# EAGLE design cervus_2_0 (EAGLE 6.4)
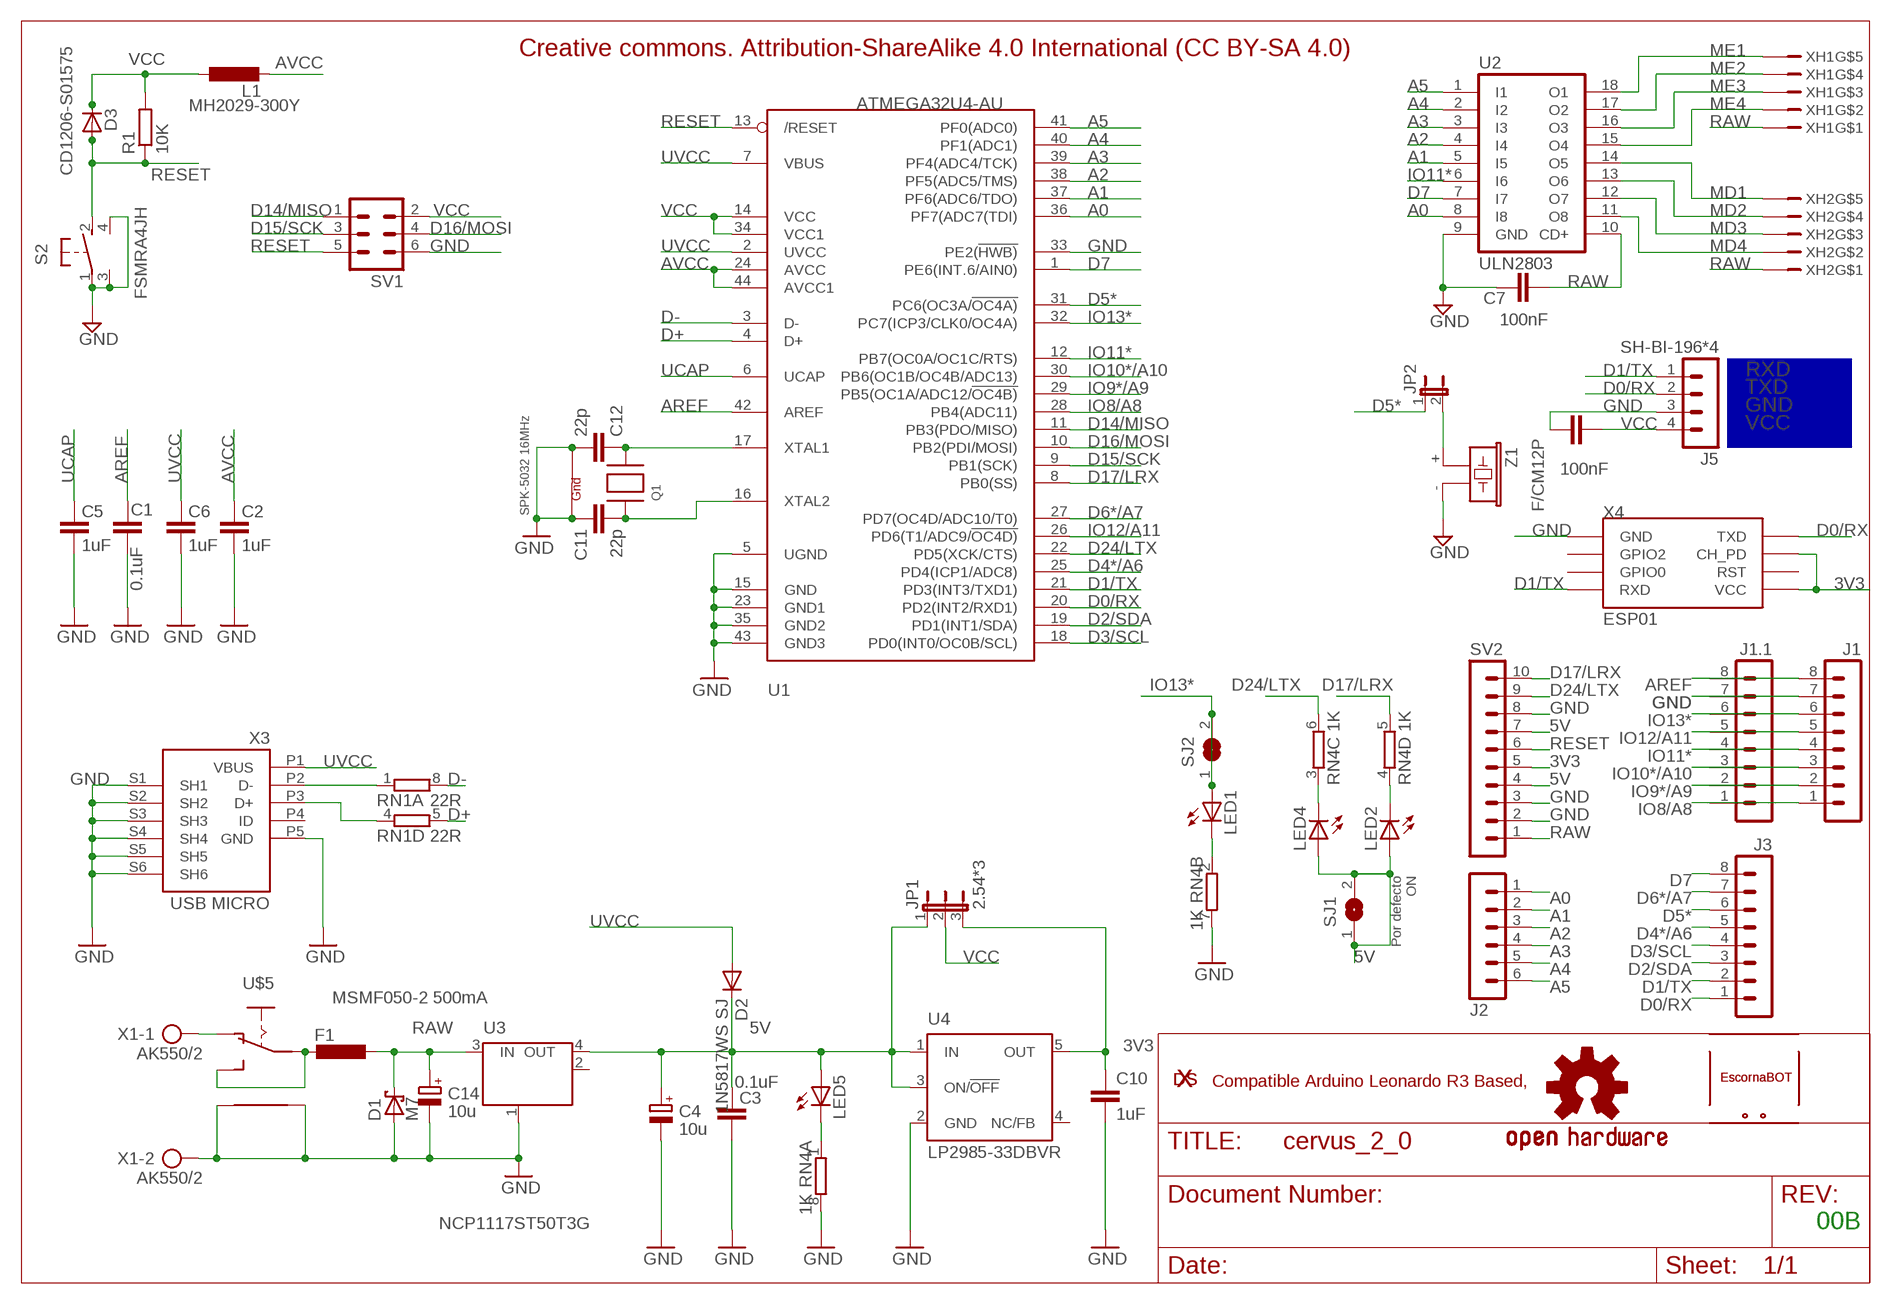
[diagram p0: schematic, sheet 1]

## Parts
C1  0.1uF  CAP0603-CAP  [0603-CAP]
C2  1uF  CAP0603-CAP  [0603-CAP]
C3  0.1uF  CAP0603-CAP  [0603-CAP]
C4  10u  CPOL-EUSMCB  [SMC_B]
C5  1uF  CAP0603-CAP  [0603-CAP]
C6  1uF  CAP0603-CAP  [0603-CAP]
C7  100nF  C-EUC0603K  [C0603K]
C8  100nF  C-EUC0603K  [C0603K]
C10  1uF  CAP0603-CAP  [0603-CAP]
C11  22p  C-EUC0603  [C0603-ROUND]
C12  22p  C-EUC0603  [C0603-ROUND]
C14  10u  CPOL-EUSMCB  [SMC_B]
D1  M7  SCHOTTKY-DIODESMA  [SMA]
D2  1N5817WS SJ  DIODESOD  [SOD-323]
D3  CD1206-S01575  DIODE-MINIMELF  [MINIMELF]
F1  MSMF050-2 500mA  L-EUL1812  [L1812]
J1  MA08-1  [MA08-1]
J1.1  MA08-1  [MA08-1]
J2  MA06-1  [MA06-1]
J3  MA08-1  [MA08-1]
J5  SH-BI-196*4  MA04-1  [MA04-1]
JP1  2.54*3  JP2E  [JP2]
JP2  JP1E  [JP1]
L1  MH2029-300Y  L-EU  [R0805]
LED1  LEDCHIPLED_0603  [CHIPLED_0603]
LED2  LEDCHIPLED_0603  [CHIPLED_0603]
LED4  LEDCHIPLED_0603  [CHIPLED_0603]
LED5  LEDCHIPLED_0603  [CHIPLED_0603]
LOGO1  OSHW-LOGOS  [OSHW-LOGO-S]
Q1  SPK-5032 16MHz  XTAL-4-3225  [NX3225]
R1  10K  R-EU_R0603  [R0603]
RN1  22R  4R-NCAY16  [CAY16]
RN4  1K  4R-NCAY16  [CAY16]
S2  FSMRA4JH  31-XX  [B3F-31XX]
SJ1  SJ  [SJ]
SJ2  SJ  [SJ]
SV1  MA03-2  [MA03-2]
SV2  MA10-1  [MA10-1]
U1  ATMEGA32U4-AU  [TQFP44]
U2  ULN2803  ULN2803A"  [DIL18]
U3  NCP1117ST50T3G  MC33269ST-3.3T3  [SOT223]
U4  LP2985-33DBVR  LP2985-XXDBVR33  [SOT23-DBV]
U$1  XDESIG  [XDESIG_CU_2]
U$2  XDESIG  [XDESIG_CU_2]
U$3  ESCORNABOT  [ESCORNA_PEQUE]
U$4  ESCORNABOT  [ESCORNA_PEQUE]
U$5  ESCORNA_SK12F14D  [ESCORNA_SK-12D07]
X1  AK550/2  [AK550/2]
X3  USB MICRO  MYCON2_USB-MINI-B  [CON2_USB_MICRO_B_AT]
X4  ESP01  [ESP01]
XH1  XH2.54-5P  B5B-XH-A  [B5B-XH-A]
XH2  XH2.54-5P  B5B-XH-A  [B5B-XH-A]
Z1  F/CM12P  [F/CM12P]

## Nets
3V3: C10.1 JP1.3 SV2.5 U4.5(OUT) X4.CH_PD X4.VCC
5V: C3.2 C4.+ D2.1(C) JP1.1 LED2.A LED4.A LED5.A SJ1.1 SJ1.2 SV2.4 SV2.7 U3.4(OUT) U4.1(IN) U4.3(ON/!OFF)
A0: J2.1 U1.36(PF7(ADC7(TDI)) U2.8(I8)
A1: J2.2 U1.37(PF6(ADC6/TDO)) U2.5(I5)
A2: J2.3 U1.38(PF5(ADC5/TMS)) U2.4(I4)
A3: J2.4 U1.39(PF4(ADC4/TCK)) U2.3(I3)
A4: J2.5 U1.40(PF1(ADC1)) U2.2(I2)
A5: J2.6 U1.41(PF0(ADC0)) U2.1(I1)
AREF [aref]: C1.2 J1.1.8 J1.8 U1.42(AREF)
AVCC: C2.2 L1.2 U1.24(AVCC) U1.44(AVCC1)
D0/RX: J3.1 J5.2 U1.20(PD2(INT2/RXD1)) X4.TX(TXD)
D1/TX: J3.2 J5.1 U1.21(PD3(INT3/TXD1)) X4.RX(RXD)
D2/SDA: J3.3 U1.19(PD1(INT1/SDA))
D3/SCL: J3.4 U1.18(PD0(INT0/OC0B/SCL))
D4*/A6: J3.5 U1.25(PD4(ICP1/ADC8))
D5*: J3.6 JP2.1 U1.31(PC6(OC3A/!OC4A))
D6*/A7: J3.7 U1.27(PD7(OC4D/ADC10/T0))
D7: J3.8 U1.1(PE6(INT.6/AIN0)) U2.7(I7)
D14/MISO: SV1.1 U1.11(PB3(PDO/MISO))
D15/SCK: SV1.3 U1.9(PB1(SCK))
D16/MOSI: SV1.4 U1.10(PB2(PDI/MOSI))
D17/LRX: RN4.5 SV2.10 U1.8(PB0(SS))
D24/LTX: RN4.6 SV2.9 U1.22(PD5(XCK/CTS))
D+: RN1.5 U1.4(D+)
D-: RN1.8 U1.3(D-)
GND [power]: C1.1 C2.1 C3.1 C4.- C5.1 C6.1 C7.1 C8.1 C10.2 C11.1 C12.2 C14.- D1.A J1.1.7 J1.7 J5.3 Q1.2(G2) Q1.4(G1) RN4.7 RN4.8 S2.1(P) S2.3(CH2) S2.4(CH1) SV1.6 SV2.2 SV2.3 SV2.8 U1.5(UGND) U1.15(GND) U1.23(GND1) U1.33(PE2(!HWB)) U1.35(GND2) U1.43(GND3) U2.9(GND) U3.1(GND/ADJ) U4.2(GND) U$5.P$4 U$5.P$5 X1.2 X3.P5(GND) X3.S1(SH1) X3.S2(SH2) X3.S3(SH3) X3.S4(SH4) X3.S5(SH5) X3.S6(SH6) X4.GND Z1.-
IO8/A8: J1.1 J1.1.1 U1.28(PB4(ADC11))
IO9*/A9: J1.1.2 J1.2 U1.29(PB5(OC1A/ADC12/!OC4B))
IO10*/A10: J1.1.3 J1.3 U1.30(PB6(OC1B/OC4B/ADC13))
IO11*: J1.1.4 J1.4 U1.12(PB7(OC0A/OC1C/RTS)) U2.6(I6)
IO12/A11: J1.1.5 J1.5 U1.26(PD6(T1/ADC9/!OC4D))
IO13*: J1.1.6 J1.6 LED1.A SJ2.1 SJ2.2 U1.32(PC7(ICP3/CLK0/OC4A))
MD1: U2.14(O5) XH2.P$5
MD2: U2.13(O6) XH2.P$4
MD3: U2.12(O7) XH2.P$3
MD4: U2.11(O8) XH2.P$2
ME1: U2.18(O1) XH1.P$5
ME2: U2.17(O2) XH1.P$4
ME3: U2.16(O3) XH1.P$3
ME4: U2.15(O4) XH1.P$2
N$1: LED5.C RN4.1
N$2: LED1.C RN4.2
N$3: LED4.C RN4.3
N$4: LED2.C RN4.4
N$5: F1.2 U$5.P$1(P) U$5.P$3(S)
N$6: C11.2 Q1.1(X1) U1.16(XTAL2)
N$9: C12.1 Q1.3(X2) U1.17(XTAL1)
N$11: JP2.2 Z1.+
N$13: RN1.1 X3.P2(D-)
N$14: RN1.4 X3.P3(D+)
N$15: U$5.P$2(O) X1.1
RAW: C7.2 C14.+ D1.C F1.1 SV2.1 U2.10(CD+) U3.3(IN) XH1.P$1 XH2.P$1
RESET: D3.A R1.1 S2.2(S) SV1.5 SV2.6 U1.13(/RESET)
UCAP: C5.2 U1.6(UCAP)
UVCC: C6.2 D2.2(A) U1.2(UVCC) U1.7(VBUS) X3.P1(VBUS)
VCC: C8.2 D3.C J5.4 JP1.2 L1.1 R1.2 SV1.2 U1.14(VCC) U1.34(VCC1)
Unconnected: RN1.2 RN1.3 RN1.6 RN1.7 U3.2(OUT) U4.4(NC/FB) X3.P4(ID) X4.GPIO0 X4.GPIO2 X4.RST

## Notes on the sheet
- Creative commons. Attribution-ShareAlike 4.0 International (CC BY-SA 4.0)
- RXD
- TXD
- GND
- VCC
- Por defecto
  ON
- Compatible Arduino Leonardo R3 Based,
- 00B

## Library data of the parts
C1-C3 C5 C6 C10 = SparkFun:CAP: Capacitor Standard 0603 ceramic capacitor, and 0.1" leaded capacitor.
C4 C14 = rcl:CPOL-EU: POLARIZED CAPACITOR, European symbol
C7 C8 = rcl:C-EU: CAPACITOR, European symbol
C11 C12 = SmartPrj:C-EU: CAPACITOR, European symbol
D1 = diode:SCHOTTKY-DIODE: Schottky Diode
D2 = SparkFun:DIODE: Diode These are standard reverse protection diodes and small signal diodes. SMA package can handle up to about 1A. SOD-323 can handle about 200mA. What the SOD-323 package when ordering, there are some mfgs out there that are 5-pin packages.
D3 = diode:DIODE-: DIODE
F1 L1 = rcl:L-EU: INDUCTOR, European symbol
J1 J1.1 J3 = con-lstb:MA08-1: PIN HEADER; OC_FARNELL: unknown; OC_NEWARK: unknown
J2 = con-lstb:MA06-1: PIN HEADER; OC_FARNELL: unknown; OC_NEWARK: unknown
J5 = con-lstb:MA04-1: PIN HEADER; OC_FARNELL: unknown; OC_NEWARK: unknown
JP1 = jumper:JP2E: JUMPER
JP2 = jumper:JP1E: JUMPER
LED1 LED2 LED4 LED5 = led:LED: LED OSRAM: - CHIPLED LG R971, LG N971, LY N971, LG Q971, LY Q971, LO R971, LY R971 LH N974, LH R974 LS Q976, LO Q976, LY Q976 LO Q996 - Hyper CHIPLED LW Q18S LB Q993, LB Q99A, LB R99A - SideLED LS A670, LO A670, LY A670, LG A670, LP A670 LB A673, LV A673, LT A673, LW A673 LH A674 LY A675 LS A676, LA A676, LO A676, LY A676, LW A676 LS A679, LY A679, LG A679 - Hyper Micro SIDELED® LS Y876, LA Y876, LO Y876, LY Y876 LT Y87S - SmartLED LW L88C, LW L88S LB L89C, LB L89S, LG L890 LS L89K, LO L89K, LY L89K LS L896, LA L896, LO L896, LY L896 - TOPLED LS T670, LO T670, LY T670, LG T670, LP T670 LSG T670, LSP T670, LSY T670, LOP T670, LYG T670 LG T671, LOG T671, LSG T671 LB T673, LV T673, LT T673, LW T673 LH T674 LS T676, LA T676, LO T676, LY T676, LB T676, LH T676, LSB T676, LW T676 LB T67C, LV T67C, LT T67C, LS T67K, LO T67K, LY T67K, LW E67C LS E67B, LA E67B, LO E67B, LY E67B, LB E67C, LV E67C, LT E67C LW T67C LS T679, LY T679, LG T679 LS T770, LO T770, LY T770, LG T770, LP T770 LB T773, LV T773, LT T773, LW T773 LH T774 LS E675, LA E675, LY E675, LS T675 LS T776, LA T776, LO T776, LY T776, LB T776 LHGB T686 LT T68C, LB T68C - Hyper Mini TOPLED® LB M676 - Mini TOPLED Santana® LG M470 LS M47K, LO M47K, LY M47K Source: http://www.osram.convergy.de LUXEON: - LUMILED® LXK2-PW12-R00, LXK2-PW12-S00, LXK2-PW14-U00, LXK2-PW14-V00 LXK2-PM12-R00, LXK2-PM12-S00, LXK2-PM14-U00 LXK2-PE12-Q00, LXK2-PE12-R00, LXK2-PE12-S00, LXK2-PE14-T00, LXK2-PE14-U00 LXK2-PB12-K00, LXK2-PB12-L00, LXK2-PB12-M00, LXK2-PB14-N00, LXK2-PB14-P00, LXK2-PB14-Q00 LXK2-PR12-L00, LXK2-PR12-M00, LXK2-PR14-Q00, LXK2-PR14-R00 LXK2-PD12-Q00, LXK2-PD12-R00, LXK2-PD12-S00 LXK2-PH12-R00, LXK2-PH12-S00 LXK2-PL12-P00, LXK2-PL12-Q00, LXK2-PL12-R00 Source: www.luxeon.com KINGBRIGHT: KA-3528ASYC Source: www.kingbright.com
LOGO1 = SparkFun-Aesthetics:OSHW-LOGO: Open Source Hardware Logo This logo indicates the piece of hardware it is found on incorporates a OSHW license and/or adheres to the definition of open source hardware found here: http://freedomdefined.org/OSHW
Q1 = adafruit:XTAL-4: Classic 4-pin 3.2 x 2.5mm crystal
R1 = rcl:R-EU_: RESISTOR, European symbol
RN1 RN4 = resistor-dil:4R-N: Array Chip Resistor Source: RS Component / Phycomp
S2 = switch-omron:31-XX: OMRON SWITCH; MPN: B3F-3100; OC_FARNELL: 959704; OC_NEWARK: 36M3582
SJ1 SJ2 = jumper:SJ: SMD solder JUMPER
SV1 = con-lstb:MA03-2: PIN HEADER; OC_FARNELL: unknown; OC_NEWARK: unknown
SV2 = con-lstb:MA10-1: PIN HEADER; OC_FARNELL: unknown; OC_NEWARK: unknown
U1 = adafruit:ATMEGA32U4: http://www.ladyada.net/library/eagle
U2 = uln-udn:ULN2803A: DRIVER ARRAY
U3 = linear:MC33269ST*: Adjustable Output Low Dropout Voltage Regulator 800 mA Source: http://www.onsemi.com/pub/Collateral/MC33269-D.PDF
U4 = SmartPrj:LP2985-XXDBVR: ULTRALOW-POWER 50-mA LOW-DROPOUT LINEAR REGULATORS 50-mA Low-Dropout Regulator Source: http://focus.ti.com/lit/ds/symlink/tps77001.pdf
U$1 U$2 = xdesig:XDESIG
U$3 U$4 = escorna:ESCORNABOT
U$5 = Escorna_CPU_2_01:ESCORNA_SK12F14
X1 = con-ptr500:AK550/2: CONNECTOR; OC_FARNELL: unknown; OC_NEWARK: unknown
X3 = SmartPrj:MYCON2_USB-MINI-B
X4 = esp8266modules:ESP01: ESP8266 Wifi module 01
XH1 XH2 = con-jst:B5B-XH-A
Z1 = buzzer:F/CM12P: BUZZER Source: Buerklin; OC_FARNELL: unknown; OC_NEWARK: unknown

## Net classes
0 default: width 0.254 mm, drill 0.61 mm, clearance 0.254 mm
1 power: width 0.254 mm, drill 0.61 mm, clearance 0.254 mm
2 gnd: width 0.254 mm, drill 0.61 mm, clearance 0.254 mm
3 usbvcc: width 0.254 mm, drill 0.61 mm, clearance 0.254 mm
4 aref: width 0.254 mm, drill 0.61 mm, clearance 0.254 mm

## Board
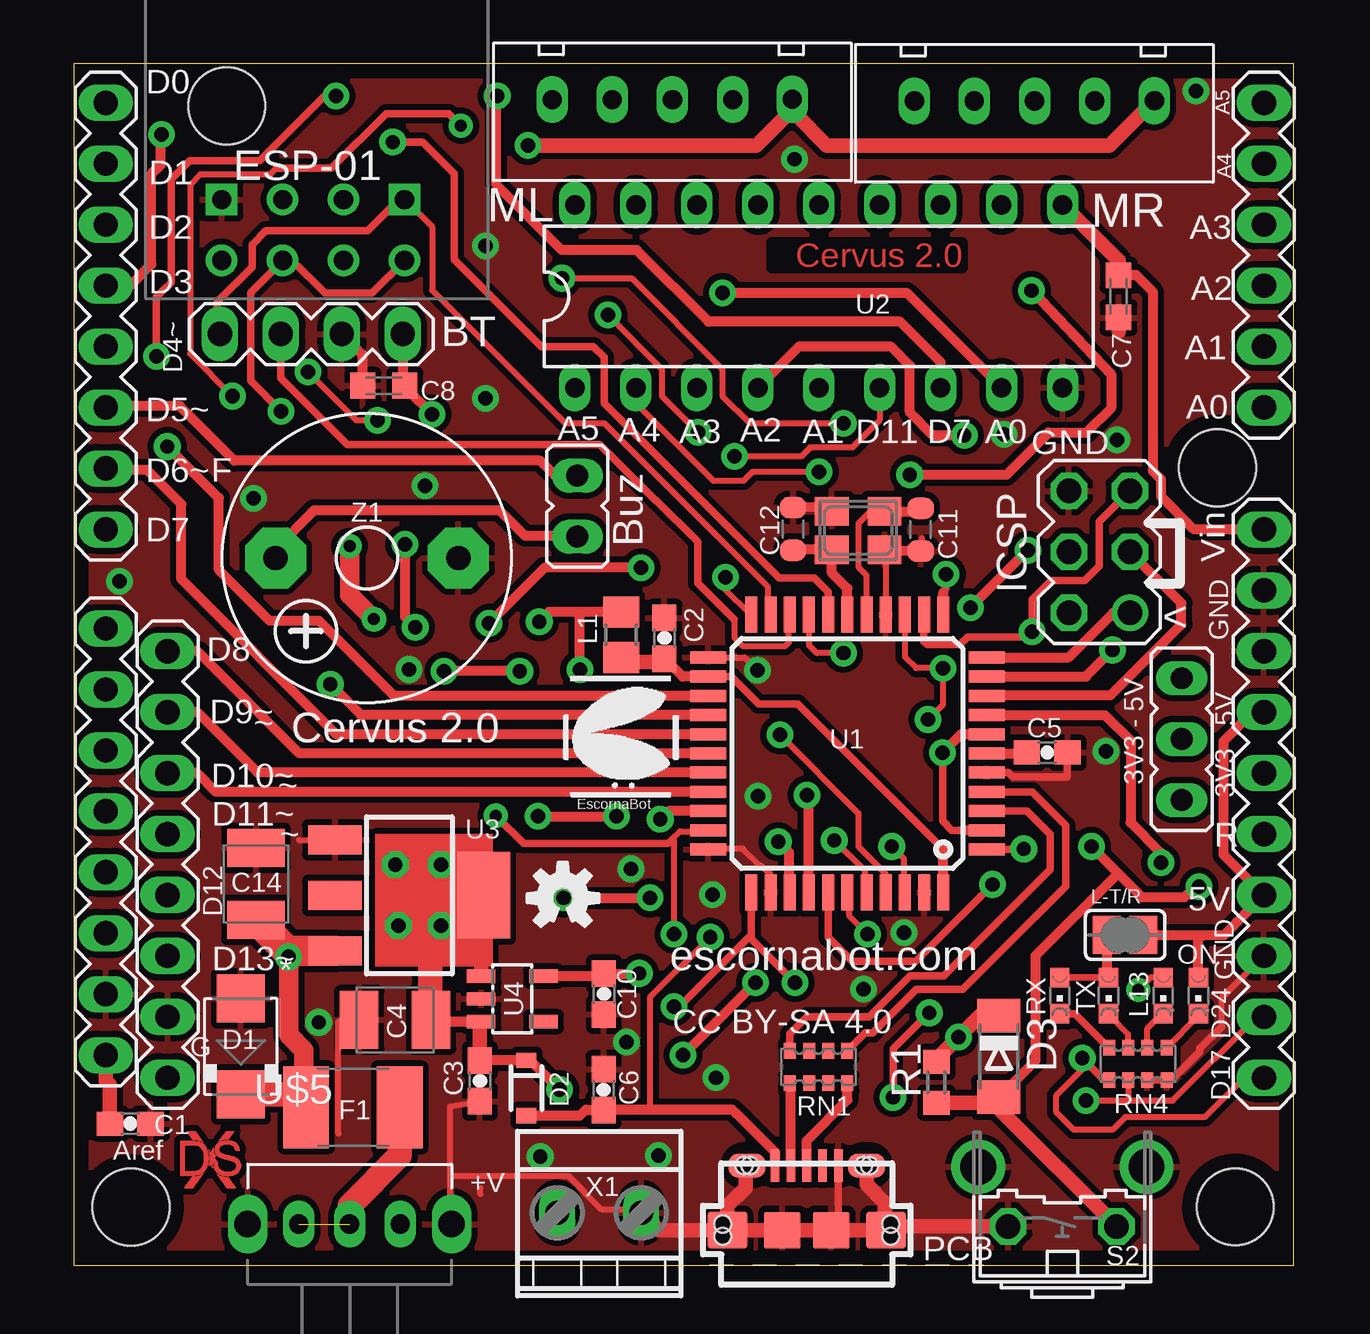
[diagram p1: board, top side]
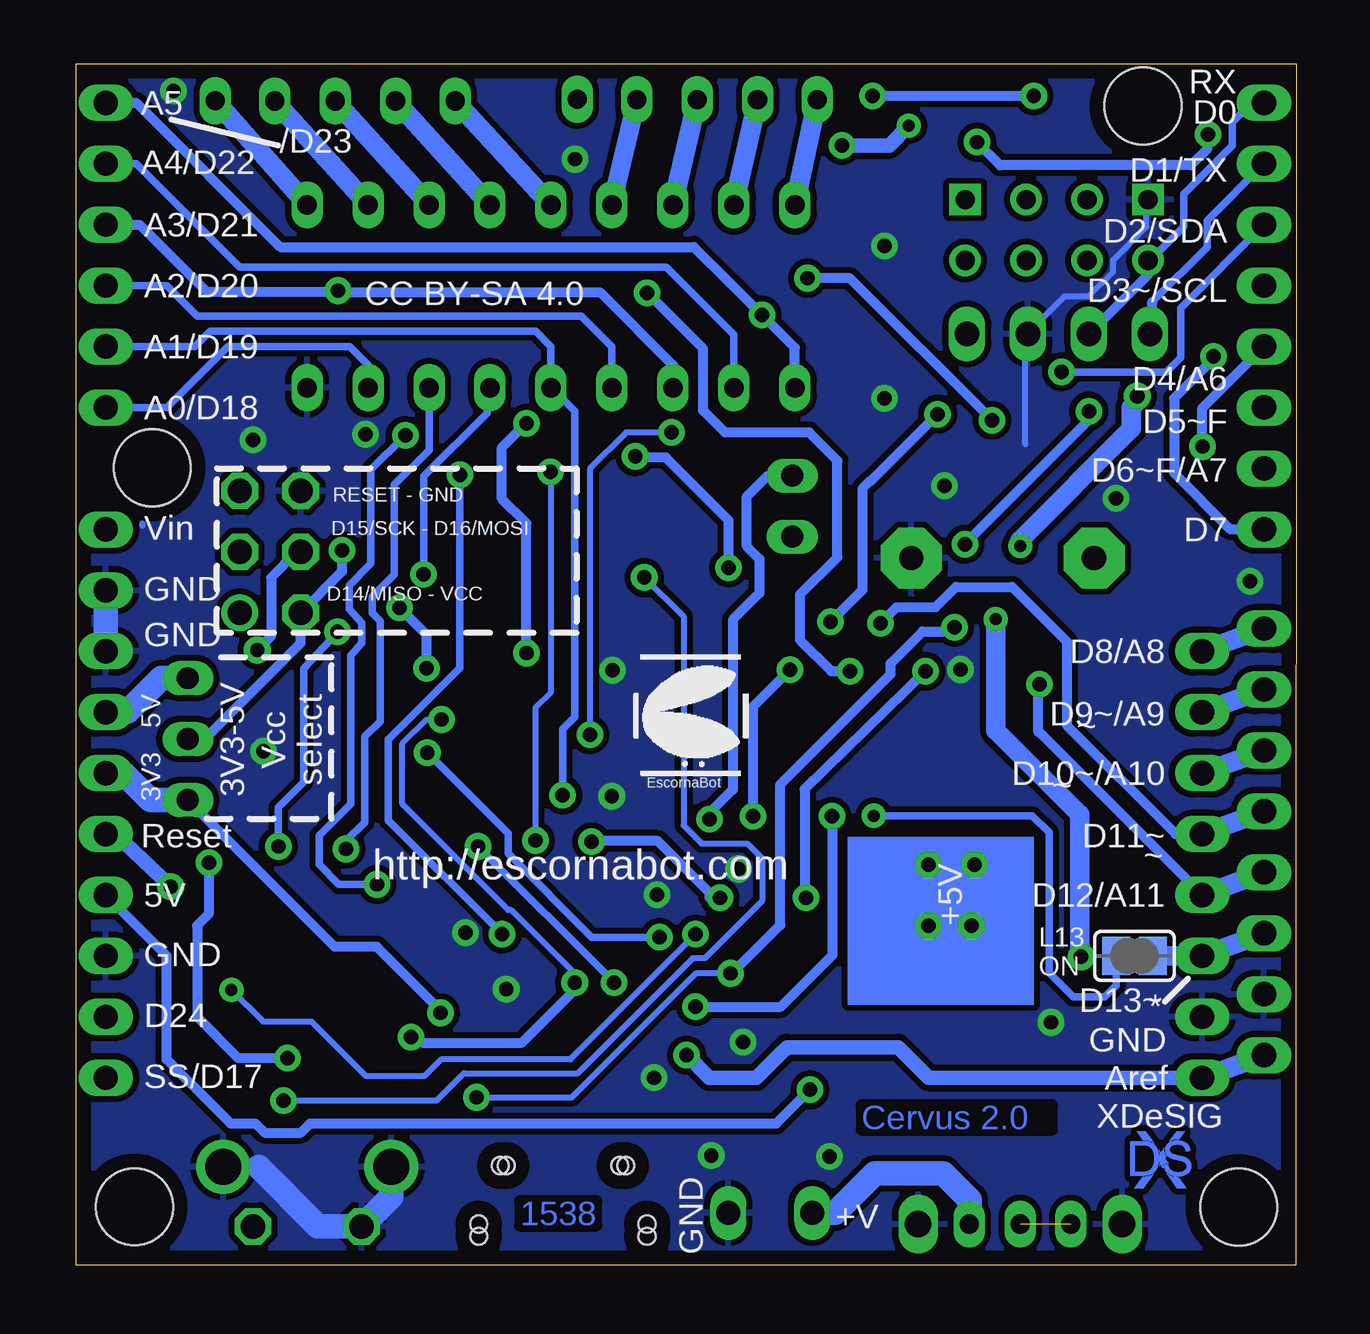
[diagram p2: board, bottom side, seen from below]

Size 50.83 x 50.08 mm. Coordinates in mm from the lower left corner, seen from the top.
Outline: 50.83,50.08 0,50.08 0,0 50.83,0.01 50.83,50.08
Copper layers (1*16): Top 0.035mm / dielectric 1.5mm / Bottom 0.035mm
Design rules "default *": minimum track width 10mil, minimum drill 22mil, track to track 10mil, track to pad 10mil, pad to pad 8mil, via to via 12mil, smd to smd 8mil, copper to edge 24mil, drill to drill 12mil, minimum pad ring 10mil, minimum via ring 10mil, stop-mask expansion 2mil, vias tented up to drill 30mil, thermal gap 10mil
Holes 3.2 mm at 6.38,48.32 48.4,2.43 2.39,2.42 47.66,33.24
tRestrict: area 31.8,30.9 to 34.3,32.1; area 33.4,27.8 to 35.9,29.1; area 34.1,27.6 to 36.6,28.9; area 36.1,18.4 to 37.3,20.9; area 26.9,16.8 to 27.6,25.3; area 33.5,16.3 to 36,17.6; area 43.6,7.8 to 46.1,9.1

### Footprints (pad centres in the part's own frame; a part is rotated, then mirrored left to right if it is on the bottom)
0603-CAP = smd 1.1 x 1: 1 -0.85,0; 2 0.85,0
SMC_B = smd 1.6 x 2.4: + -1.5,0; - 1.5,0
C0603K = smd 1.05 x 1.08: 1 -0.875,0; 2 0.875,0
C0603-ROUND = smd 0.898 x 1.1: 1 -0.889,0; 2 0.889,0
SMA = smd 2 x 2: A 2,0; C -2,0
SOD-323 = smd 0.63 x 0.83: 1 -1.15,0; 2 1.15,0
MINIMELF = smd 1.4 x 1.8: A 1.7,0; C -1.7,0
L1812 = smd 1.9 x 3.4: 1 -1.95,0; 2 1.95,0
MA08-1 = drill 1.016 long: 1 -8.89,0; 2 -6.35,0; 3 -3.81,0; 4 -1.27,0; 5 1.27,0; 6 3.81,0; 7 6.35,0; 8 8.89,0
MA06-1 = drill 1.016 long: 1 -6.35,0; 2 -3.81,0; 3 -1.27,0; 4 1.27,0; 5 3.81,0; 6 6.35,0
MA04-1 = drill 1.016 long: 1 -3.81,0; 2 -1.27,0; 3 1.27,0; 4 3.81,0
JP2 = drill 0.914 long: 1 -2.54,0; 2 0,0; 3 2.54,0
JP1 = drill 0.914 long: 1 0,-1.27; 2 0,1.27
R0805 = smd 1.3 x 1.5: 1 -0.95,0; 2 0.95,0
CHIPLED_0603 = smd 0.8 x 0.8: A 0,-0.75; C 0,0.75
NX3225 = smd 1.4 x 1.2: 1 -1.1,-0.8; 2 1.1,-0.8; 3 1.1,0.8; 4 -1.1,0.8
R0603 = smd 1 x 1.1: 1 -0.85,0; 2 0.85,0
CAY16 = smd 0.5 x 0.65: 1 -1.2,-0.675; 2 -0.4,-0.675; 3 0.4,-0.675; 4 1.2,-0.675; 5 1.2,0.675; 6 0.4,0.675; 7 -0.4,0.675; 8 -1.2,0.675
B3F-31XX = drill 1.016 octagon: 1 -2.261,-1.245; 2 2.261,-1.245 | drill 1.499 pad 2.159: 3 -3.505,1.245; 4 3.505,1.245
SJ = smd 1.168 x 1.6: 1 -0.762,0; 2 0.762,0
MA03-2 = drill 1.016: 1 -2.54,-1.27 | drill 1.016 octagon: 2 -2.54,1.27; 3 0,-1.27; 4 0,1.27; 5 2.54,-1.27; 6 2.54,1.27
MA10-1 = drill 1.016 long: 1 -11.43,0; 2 -8.89,0; 3 -6.35,0; 4 -3.81,0; 5 -1.27,0; 6 1.27,0; 7 3.81,0; 8 6.35,0; 9 8.89,0; 10 11.43,0
TQFP44 = smd 1.5 x 0.5: 1 -5.8,4; 2 -5.8,3.2; 3 -5.8,2.4; 4 -5.8,1.6; 5 -5.8,0.8; 6 -5.8,0; 7 -5.8,-0.8; 8 -5.8,-1.6; 9 -5.8,-2.4; 10 -5.8,-3.2; 11 -5.8,-4; 23 5.8,-4; 24 5.8,-3.2; 25 5.8,-2.4; 26 5.8,-1.6; 27 5.8,-0.8; 28 5.8,0; 29 5.8,0.8; 30 5.8,1.6; 31 5.8,2.4; 32 5.8,3.2; 33 5.8,4 | smd 0.5 x 1.5: 12 -4,-5.8; 13 -3.2,-5.8; 14 -2.4,-5.8; 15 -1.6,-5.8; 16 -0.8,-5.8; 17 0,-5.8; 18 0.8,-5.8; 19 1.6,-5.8; 20 2.4,-5.8; 21 3.2,-5.8; 22 4,-5.8; 34 4,5.8; 35 3.2,5.8; 36 2.4,5.8; 37 1.6,5.8; 38 0.8,5.8; 39 0,5.8; 40 -0.8,5.8; 41 -1.6,5.8; 42 -2.4,5.8; 43 -3.2,5.8; 44 -4,5.8
DIL18 = drill 0.813 long: 1 -10.16,-3.81; 2 -7.62,-3.81; 3 -5.08,-3.81; 4 -2.54,-3.81; 5 0,-3.81; 6 2.54,-3.81; 7 5.08,-3.81; 8 7.62,-3.81; 9 10.16,-3.81; 10 10.16,3.81; 11 7.62,3.81; 12 5.08,3.81; 13 2.54,3.81; 14 0,3.81; 15 -2.54,3.81; 16 -5.08,3.81; 17 -7.62,3.81; 18 -10.16,3.81
SOT223 = smd 1.219 x 2.235: 1 -2.311,-3.099; 2 0,-3.099; 3 2.311,-3.099 | smd 3.6 x 2.2: 4 0,3.099
SOT23-DBV = smd 0.55 x 1.2: 1 -0.95,-1.3; 2 0,-1.3; 3 0.95,-1.3; 4 0.95,1.3; 5 -0.95,1.3
ESCORNA_SK-12D07 = drill 0.8 long: P$1 0,0; P$2 2.115,0; P$3 -2.115,0 | drill 1.1 pad 1.422 long: P$4 -4.25,0; P$5 4.25,0
AK550/2 = drill 1 pad 1.5 long: 1 -1.75,0; 2 1.75,0
CON2_USB_MICRO_B_AT = smd 0.406 x 1.346: P1 -1.321,2.692; P2 -0.66,2.692; P3 0,2.692; P4 0.66,2.692; P5 1.321,2.692 | smd 1.651 x 1.549: S1 -3.302,0; S2 3.302,0 | smd 1.524 x 1.016: S3 -2.489,2.692; S4 2.489,2.692 | smd 1.524 x 1.524: S5 -1.016,0; S6 1.016,0 | hole 0.7: -3.505,0.254; -3.505,-0.254; 3.505,0.254; 3.505,-0.254; -2.616,2.692; -2.362,2.692; 2.362,2.692; 2.616,2.692
ESP01 = drill 0.8: CH_PD -1.285,-8.178; GPIO0 1.255,-5.638; GPIO2 -1.285,-5.638; RST 1.255,-8.178; TX -3.825,-8.178; VCC 3.795,-8.178 | drill 0.8 square: GND -3.825,-5.638; RX 3.795,-5.638
B5B-XH-A = drill 0.8 long: P$1 -5.17,-0.19; P$2 -2.69,-0.175; P$3 -0.175,-0.175; P$4 2.34,-0.175; P$5 4.83,-0.175
F/CM12P = drill 1.016 pad 2.54 octagon: + 3.81,0; - -3.81,0

### Placement (x,y rotation side)
C1  2.36,5.9 180 top
C2  24.62,26.14 270 top
C3  16.93,7.68 90 top
C4  13.4,10.22 180 top
C5  40.56,21.37 180 top
C6  22.08,7.32 270 top
C7  43.54,40.38 90 top
C8  12.93,36.66 0 top
C10  22.1,11.3 270 top
C11  35.3,30.66 90 top
C12  29.98,30.69 90 top
C14  7.6,15.89 90 top
D1  6.96,9.12 90 top
D2  18.86,7.39 270 top
D3  38.55,8.7 270 top
F1  11.64,6.58 0 top
J1  3.91,16.7 270 top
J1.1  1.34,17.65 270 top
J2  49.6,42.1 90 top
J3  1.34,39.56 270 top
J5  9.9,38.82 0 top
JP1  46.17,21.93 270 top
JP2  20.99,31.64 180 top
L1  22.81,26.28 270 top
LED1  45.4,11.24 180 top
LED2  41.09,11.24 180 top
LED4  43.12,11.24 180 top
LED5  46.87,11.24 180 top
LOGO1  20.38,15.3 0 top
Q1  32.69,30.62 180 top
R1  35.94,7.62 90 top
RN1  31.04,8.26 0 top
RN4  44.34,8.39 180 top
S2  41.2,2.86 0 top
SJ1  43.81,13.77 180 top
SJ2  6.73,12.89 0 bottom
SV1  42.74,29.73 90 top
SV2  49.6,19.24 270 top
U1  32.24,21.33 180 top
U2  31.05,40.39 0 top
U3  13.99,15.42 270 top
U4  18.28,11.1 270 top
U$1  4.44,3.22 0 top
U$2  6.89,3.21 0 bottom
U$3  20.33,19.42 0 top
U$4  27.69,20.32 0 bottom
U$5  11.5,1.72 0 top
X1  21.9,2.18 0 top
X3  30.55,1.46 0 top
X4  9.99,50.06 0 top
XH1  24.78,48.41 180 top
XH2  39.86,48.35 180 top
Z1  12.22,29.48 180 top

### Tracks (layer width: path | path; a pad name or v marks a point on that pad's centre or on a via)
3V3  (via drill 0.6)
  Top 0.305: v34.14,7 34.14,9.01 v35.65,10.52 | X4.VCC 12.42,40.51 10.48,40.51 9.12,41.88 X4.CH_PD 7.37,40.54 7.37,36.86 v8.63,35.6
  Top 0.406: v13.8,30.05 13.8,27.02 v14.23,26.59 | U4.5 22,12.05 C10.1 23.55,12.15 v23.56,12.16
  Bottom 0.254: v34.14,7 30.18,7 25.01,12.16 v23.56,12.16 23.5,12.16 | 45.8,19.09 JP1.3 | 8.63,35.22 v8.63,35.6
  Bottom 0.406: v13.8,30.05 8.63,35.22 | 23.5,12.16 21.48,14.18 21.48,20.05 16.89,24.64 16.89,25.08 15.56,26.42 14.41,26.42 v14.23,26.59 | v35.65,10.52 35.65,10.63 38.29,13.27 40.06,13.27 JP1.3
  Bottom 1.016: JP1.3 47.73,19.39 48.82,20.47 49.55,20.47 SV2.5
5V  (via drill 0.6)
  Top 0.254: SJ1.2 SJ1.1 | 16.95,10.15 U4.3 16.82,10.15 | 16.95,8.51 C3.2 16.95,8.38 17.06,8.54 | 14.93,10.52 14.93,10.27 C4.+ 14.93,10.15 | 41.13,11.99 LED4.A LED2.A
  Top 0.305: LED4.A 43.08,11.99 43.05,12.02
  Top 0.406: 49.12,23.05 47.91,21.84 47.91,17.12 SV2.7 | v20.25,7.31 19.15,8.41 D2.1 17.06,8.54 | 48.46,14.3 SV2.7 | SJ1.1 46.93,13.77 | 46.93,13.77 47.05,13.77 | 47.05,13.77 47.93,13.77 SV2.7 | 46.89,13.68 46.93,13.77 | SJ1.2 43.05,12.02 | 16.95,10.15 14.98,10.15 C4.+ | 15.13,12.05 14.86,12.32 | U3.4 17.84,16.17 17.84,16.7 v15.31,16.7 v13.4,16.7 | v13.53,14.16 v15.31,14.16 | 16.57,14.16 v15.31,14.16 | v15.31,14.16 15.31,13.34 14.86,12.89 | LED5.A 46.87,13.58 47.05,13.77
  Top 0.61: SV2.4 49.12,23.05 | C3.2 16.93,10.1 U4.3 | U4.1 16.98,13.76 16.57,14.16
  Top 1.016: U3.4 17.09,15.37 14.86,13.15 14.86,12.89 14.86,12.32 14.86,10.26 C4.+
  Bottom 0.254: 49.58,15.31 SV2.7
  Bottom 0.406: 48.69,23.07 48.35,23.07 48.33,23.05 | v20.25,7.31 21.66,5.91 41.08,5.91 41.47,5.52 42.97,5.52 43.36,5.91 44.39,5.91 46.02,7.54 46.03,7.54 47.06,8.58 47.06,12.9 SV2.7
  Bottom 1.016: JP1.1 47.29,24.47 48.69,23.07 49.58,23.07 SV2.4
A0  (via drill 0.6)
  Top 0.254: 29.8,15.56 U1.36
  Top 0.406: 29.8,15.56 29.8,17.21 v29.36,17.66 | v20.41,15.31 v24,15.31 | v18.59,24.76 v15.43,24.76 | v27.04,40.54 34.71,40.54 U2.8
  Bottom 0.305: J2.1 47.05,35.75 44.52,38.29 39.44,38.29 38.66,37.52 U2.8
  Bottom 0.406: v15.43,24.76 20.48,19.85 20.48,15.38 v20.41,15.31 | v27.04,40.54 24.7,38.2 24.7,35.62 23.79,34.71 20.28,34.71 19.11,33.54 19.11,29.51 20.67,27.95 20.67,26.07 19.37,24.77 v18.59,24.77 v18.59,24.76 | v24,15.31 24.43,15.31 24.43,15.53 26.59,17.68 29.34,17.68 v29.36,17.66
A1  (via drill 0.6)
  Top 0.406: U1.37 30.64,19.52 v30.56,19.6
  Bottom 0.254: 30.93,36.48 U2.5
  Bottom 0.305: U2.5 31.05,38.29 31.68,38.93 45.24,38.93 45.88,38.29 J2.2 | v30.56,19.6 30.56,22.35 30.05,22.85 30.05,35.6 30.93,36.48
A2  (via drill 0.6)
  Top 0.254: 31.44,15.44 U1.38 | 28.54,36.61 U2.4
  Top 0.305: 38.24,15.87 v38.29,15.87 35.09,12.67 32.44,12.67 31.44,13.67 31.44,15.44
  Top 0.406: v37.11,34.59 35.8,34.59 34.84,35.55 34.84,37.5 34.06,38.28 30.21,38.28 U2.4
  Bottom 0.305: U2.4 28.5,38.29 29.77,39.56 45.79,39.56 47.05,40.83 J2.3 | v38.29,15.87 39.88,15.87 40.71,16.7 40.71,17.92 39.39,19.24 39.39,25.41 38.94,25.93 38.94,26.78 39.46,27.36 39.46,28.34 38.55,29.25 38.55,33.15 v37.11,34.59
A3  (via drill 0.6)
  Top 0.254: v33.08,13.8 32.32,14.56 32.32,15.44 U1.39
  Top 0.406: v34.84,32.95 38.87,32.95 40.62,34.71 42.2,34.71 43.25,35.75 43.25,37.09 v39.91,40.62
  Bottom 0.305: v33.08,13.8 37.82,18.54 37.82,21.91 34.84,24.89 v34.84,32.95 | 39.85,40.56 v39.91,40.62 39.98,40.56
  Bottom 0.406: U2.3 25.96,37.52 29,40.56 39.85,40.56 | J2.4 48.19,43.37 45.37,40.56 39.98,40.56
A4  (via drill 0.6)
  Top 0.254: v31.69,17.7 32.95,16.45 32.95,15.56 U1.40 | v31.06,33.08 28.29,33.08 27.91,32.7 26.65,32.7 23.5,35.85 23.5,36.48 U2.2
  Bottom 0.254: v31.69,17.7 31.69,23.24 31.06,23.87 v31.06,33.08
  Bottom 0.305: U2.2 23.43,38.79 26.23,41.6 44.01,41.6 44.51,42.1 44.52,42.1 48.33,45.91 J2.5
A5  (via drill 0.6)
  Top 0.254: v29.42,22.11 32.7,18.84 32.7,17.45 33.83,16.32 33.83,15.56 U1.41 | v26.02,34.72 24.51,36.23 24.51,37.36 v22.26,39.61
  Bottom 0.254: v29.42,22.11 29.42,33.2 27.91,34.72 v26.02,34.72
  Bottom 0.406: J2.6 48.33,48.45 42.32,42.44 25.09,42.44 23.59,40.95 | U2.1 20.89,38.24 v22.26,39.61 23.59,40.95 | 23.59,40.95 23.6,40.95
AREF  (via drill 0.6)
  Top 0.254: v34.09,17.45 34.59,16.95 34.59,15.56 U1.42
  Top 0.406: v25.39,8.76 v28.41,11.78
  Top 0.61: C1.2 1.51,7.51 1.33,7.68 J1.1.8
  Bottom 0.305: v28.41,11.78 v34.09,17.45
  Bottom 0.61: J1.1.8 | J1.8 15.31,7.81 16.57,9.08 21.2,9.08 21.53,8.76 22.48,7.81 24.44,7.81 v25.39,8.76
  Bottom 0.813: J1.8 J1.1.8
AVCC
  Top 0.254: 24.64,25.09 24.58,25.15
  Top 0.305: U1.24 27.4,24.53 28.54,23.4 30.16,23.4 36.23,17.32
  Top 0.406: U1.44 36.23,17.32 | U1.24 25.37,24.53 C2.2 24.61,25.11 24.64,25.09
  Top 0.61: 24.58,25.15 22.82,25.15 L1.2
D0/RX
  Top 0.254: 27.53,26.9 27.53,26.15 27.89,25.8 29.64,25.8 29.8,25.96 29.8,27.03 U1.20 | 8.63,38.75 J5.2
  Top 0.305: 27.53,26.9 26,28.44 26,30.16 24.28,31.88 24.26,31.88 21.93,34.21 11.41,34.21 8.63,36.98 J5.2
  Bottom 0.254: 6.11,41.9 X4.TX
  Bottom 0.305: 1.85,48.45 2.66,47.64 2.66,46.67 4.68,44.65 4.68,43.29 6.07,41.9
  Bottom 0.406: J3.1 1.85,48.45 | 6.11,41.9 6.07,41.9 | J5.2 6.17,41.28 X4.TX
D1/TX
  Top 0.254: U1.21 28.92,27.15 28.92,28.29 22.11,35.09 20.48,35.09 14.93,40.64 14.93,43.28 13.8,44.42 X4.RX 13.67,44.54
  Top 0.305: 13.67,44.54 13.67,44.53 12.26,43.12 8,43.12 7.43,42.55 7.43,41.6 5.99,40.16 5.99,38.92 J5.1
  Bottom 0.254: 5.99,38.87 J5.1 | 1.45,45.8 J3.2
  Bottom 0.305: 5.99,40.16 3.71,42.44 3.71,43.54 J3.2
  Bottom 0.406: 5.99,38.87 5.99,40.16
D2/SDA  (via drill 0.6)
  Top 0.254: v32.07,35.09 28.16,35.09 27.03,36.23 27.03,37.36 23.25,41.14 v20.35,41.14 | v12.67,35.22 11.78,35.22 v9.77,37.23 | U1.19 30.64,25.85 30.96,25.52 v32.07,25.52
  Bottom 0.305: v9.77,37.23 5.4,37.23 4.81,37.83 4.81,39.9 J3.3
  Bottom 0.406: v20.35,41.14 18.59,41.14 v12.67,35.22 | v32.07,25.52 32.07,30.92 33.09,31.94 33.09,34.08 v32.07,35.09
D3/SCL  (via drill 0.6)
  Top 0.305: v13.29,46.81 14.54,46.81 15.86,45.5 15.86,41.92 19.49,38.29 21.66,38.29 22.1,37.85 22.1,35.94 29.4,28.64 30.86,28.64 31.43,28.07 U1.18
  Top 0.406: J3.4 2.35,40.83 3.24,41.72 3.24,45.47 3.62,45.85 3.62,47.09 v3.66,47.13
  Bottom 0.406: 13.17,46.68 v13.29,46.81 12.33,45.85 4.38,45.85 3.68,46.55 3.68,46.99 | 3.68,46.99 3.68,47.1 v3.66,47.13 | 3.68,46.99 3.88,47.18
D4*/A6  (via drill 0.6)
  Top 0.406: U1.25 13.36,23.73 10.23,26.86 8.17,26.86 6.04,28.99 6.04,31.98 v3.9,34.12
  Bottom 0.406: v3.9,34.12 3.9,35.73 J3.5
D5*  (via drill 0.6)
  Top 0.406: J3.6 1.4,35.81 4.42,35.81 6.7,33.54 19.43,33.54 20.06,32.91 JP2.1 | U1.31 24.79,18.93 v24.44,18.59
  Bottom 0.406: v24.44,18.59 24.44,18.85 23.46,19.82 23.46,26.91 22.36,28.01 22.36,29.44 22.88,29.96 22.88,32.04 22.01,32.91 JP2.1
D6*/A7
  Top 0.406: U1.27 10.95,22.13 4.49,28.6 4.49,31.72 3.06,33.15 1.4,33.15 J3.7
D7  (via drill 0.6)
  Top 0.305: U1.1 39.57,17.33 v39.59,17.35 | v3.44,37.89 3.44,40.36 3.83,40.75 3.86,40.75 4.07,40.96 4.07,45.28 4.83,46.04 7.75,46.04 10.42,48.71 10.9,48.71 v10.93,48.73
  Top 0.406: U2.7 36.12,37.65 34.45,39.32 26.45,39.32 23.46,42.31 20.34,42.31 17.61,45.04 17.61,48.7 v17.65,48.73
  Bottom 0.305: U2.7 36.12,33.98 37.57,32.54 37.57,28.79 38.48,27.88 38.48,27.18 38.16,26.86 38.16,22.67 38.8,22.03 38.8,18.46 39.59,17.68 39.59,17.48
  Bottom 0.406: v39.59,17.35 39.59,17.48 | v10.93,48.73 v17.65,48.73 | J3.8 2.73,30.67 5.08,33.02 5.08,36.13 3.44,37.77 v3.44,37.89
D14/MISO
  Top 0.406: U1.11 41.46,25.33 43.32,27.19 SV1.1
D15/SCK
  Top 0.254: 38.12,23.75 U1.9 | 44.04,29.67 SV1.3
  Top 0.406: 38.12,23.75 43.19,23.75 46.15,26.71 46.15,27.59 SV1.3
D16/MOSI  (via drill 0.6)
  Top 0.406: U1.10 42.17,24.53 v43.28,25.64
  Bottom 0.254: 41.52,29.67 SV1.4
  Bottom 0.406: 41.52,29.67 41.69,29.67 42.71,28.66 42.71,26.22 v43.28,25.64
D17/LRX  (via drill 0.6)
  Top 0.254: 43.03,7.75 RN4.5 | SV2.10 48.77,7.81 47.12,6.17 43.81,6.17 43.29,5.65 41.66,5.65 40.95,6.37 40.95,7.08 41.99,8.12 41.99,8.6 v42.02,8.63
  Top 0.305: 43.03,7.75 42.9,7.75 v42.02,8.63
  Top 0.406: U1.8 42.97,22.93 44.04,21.86 44.04,18.45 45.3,17.19 v45.3,16.78
  Bottom 0.406: v45.3,16.78 45.3,14.64 45.79,14.16 45.79,10.35 44.06,8.63 v42.02,8.63
D24/LTX  (via drill 0.6)
  Top 0.254: v27.16,28.67 27.16,28.16 28.16,27.15 U1.22 | RN4.6 43.94,6.86 | SV2.9 49.58,10.27 49.21,10.27 45.8,6.86 43.94,6.86 | v42.18,6.86 43.94,6.86
  Bottom 0.254: v27.16,28.67 25.52,27.03 25.52,18.33 24.76,17.58 22.87,17.58 22.24,16.95 22.24,15.18 24.64,12.79 25.14,12.79 29.93,8 34.67,8 35.81,6.86 v42.18,6.86
D+
  Top 0.305: U1.4 39.94,19.73 41.34,18.33 41.34,15.79 38.18,12.63 37.7,12.15 37.04,11.49 35.12,11.49 33.3,9.68 32.98,9.68 RN1.5
D-
  Top 0.305: U1.3 39.72,18.93 40.69,17.96 40.69,16.51 36.25,12.07 34.86,12.07 33.15,10.35 30.55,10.35 29.84,9.65 RN1.8
  Top 0.406: 38.05,18.91 U1.3
GND  (via drill 0.6)
  Top 0.254: 11.03,5.48 11.03,10.15 C4.- | 9.39,17.7 U3.1 | 44.67,5.1 S2.4 | 16.95,2.96 16.95,3.22 | 15.69,1.83 15.69,3.72 | 15.69,3.72 15.69,6.62 C3.1 | 15.69,3.72 20.6,3.72 21.99,2.33 23.38,2.33 X1.2 | U1.15 33.83,27.15 33.83,29.67 Q1.4 | 35.35,30.31 35.35,29.93 C11.1 | 41.39,36.35 U2.9 | 11.41,38.75 J5.3 | U1.35 29.04,16.27 28.66,16.64 28.6,16.64 27.89,17.35 26.45,17.35 U1.33 | RN4.7 RN4.8 | RN4.8 45.62,7.72 | 47.84,9.94 47.84,11.14 SV2.8 | RN4.8 45.55,7.75 RN4.8 | U1.23 27.96,25.33 v28.49,24.81
  Top 0.305: X3.P5 31.87,1.77 X3.S6 | S2.4 44.7,5.05 | U1.5 38.94,20.53 39.13,20.34 41.41,20.34 C5.1 | RN4.7 45.75,7.72 46.93,8.89 46.93,9.03 47.84,9.94
  Top 0.406: C11.1 33.84,29.77 Q1.4 | C12.2 31.36,31.65 Q1.2 | C8.1 12.05,37.94 J5.3
  Top 0.61: C7.1 43.54,38.91 | S2.1 34,1.62 X3.S2 | X3.S2 X3.S6 X3.S5 X3.S1 | X3.S1 24.37,1.46 X1.2 | X3.S3 28.06,4.05 28,4 28,3.24 27.23,2.47 X3.S1 | X3.S4 33.04,3.36 33.8,2.6 33.8,1.51 X3.S2
  Bottom 0.254: S2.4 44.67,4.1 43.66,4.1 43.23,4.09 | 23.63,2.21 X1.2 | X4.GND 6.24,44.42 6.24,43.28 7.62,41.9 7.62,41.39 8.63,40.39 9.64,40.39 11.15,38.87 J5.3 11.28,38.75 11.28,34.21 | 15.94,29.55 Z1.- | 41.27,36.23 41.27,36.48 U2.9 | 49.21,28.29 SV2.2 | 48.07,30.81 48.07,30.9
  Bottom 1.016: S2.3 37.69,2.86 S2.1 40.75,1.62 43.23,4.09 | SV2.2 SV2.3
  other vias: 17.15,36.13 1.91,28.51 30.04,46.1 17.15,42.48 46.77,48.94 38.77,34.63 43.47,34.4 23.04,9.3 24.37,4.57 19.44,4.53 43.02,21.43 26.62,15.44 28.51,19.55 32.91,11.51 26.76,7.81 34.6,13.86 23.22,16.52 14.65,32.49 7.5,31.97 13.98,24.83 10.21,10.12
  pour Top: -0.06,50.99 50.87,50.99 50.87,0.19 0.07,0.19
  pour Bottom: -0.38,50.74 50.87,50.99 50.87,0.19 0.07,0.19
IO8/A8
  Top 0.406: U1.28 9.41,21.33 5.15,25.59 J1.1
  Bottom 0.813: J1.1 J1.1.1
IO9*/A9
  Top 0.406: U1.29 7.67,20.53 5.15,23.05 J1.2
  Bottom 0.813: J1.2 J1.1.2
IO10*/A10
  Top 0.406: U1.30 5.92,19.73 5.15,20.51 J1.3
  Bottom 0.813: J1.3 J1.1.3
IO11*  (via drill 0.6)
  Top 0.254: v36.35,28.79 36.35,28.16 36.23,28.04 | v27.53,33.71 30.3,33.71 30.68,34.08 32.45,34.08 33.58,35.22 33.58,36.48 U2.6
  Top 0.406: U1.12 36.23,28.04 | v23.64,29.07 19.62,29.07 v17.31,26.76
  Bottom 0.254: 33.71,35.6 33.71,36.48 U2.6
  Bottom 0.305: 33.71,35.6 33.71,35.51 36.34,32.89 36.34,28.81 v36.35,28.79
  Bottom 0.406: v23.64,29.07 23.64,31.04 26.26,33.67 27.49,33.67 v27.53,33.71 | v17.31,26.76 16.64,27.43 15.02,27.43 14.17,28.27 11.83,28.27 9.53,25.97 9.53,22.48 5.02,17.97 J1.4
  Bottom 0.813: J1.4 J1.1.4
IO12/A11  (via drill 0.6)
  Top 0.406: U1.26 11.98,22.93 v10.69,24.22
  Bottom 0.406: v10.69,24.22 10.73,24.18 10.73,22.23 10.71,22.23 J1.5
  Bottom 0.61: J1.1.5
  Bottom 0.813: J1.5 J1.1.5
IO13*  (via drill 0.5, 0.6)
  Top 0.254: 24.76,17.58 24.95,17.77 | 24.95,17.77 25.27,18.08 26.4,18.08 U1.32 | v25.01,13.8 25.01,17.7 24.95,17.77 | 45.41,12.01 LED1.A 44.87,11.99 v44.36,11.48
  Top 0.305: 24.76,17.58 18.75,17.58 v17.59,18.73
  Bottom 0.254: SJ2.1 SJ2.2 | v44.36,11.48 43.04,10.16 41.02,10.16 38.74,7.87 36.32,7.87 35.62,8.57 30.24,8.57 v25.01,13.8
  Bottom 0.305: v17.59,18.73 10.99,18.73 10.29,18.03 10.29,12.19 9.27,11.18 7.98,11.18 7.5,11.66 SJ2.1
  Bottom 0.813: J1.1.6 J1.6 SJ2.2
MD1
  Bottom 0.813: U2.14 XH2.P$5
MD2
  Bottom 0.813: U2.13 XH2.P$4
MD3
  Bottom 0.813: U2.12 XH2.P$3
MD4
  Bottom 0.813: U2.11 XH2.P$2
ME1
  Bottom 0.813: XH1.P$5 U2.18
ME2
  Bottom 0.813: XH1.P$4 U2.17
ME3
  Bottom 0.813: XH1.P$3 U2.16
ME4
  Bottom 0.813: XH1.P$2 U2.15
N$1
  Top 0.254: 45.54,9.16 RN4.1 46.87,10.39 LED5.C
N$2
  Top 0.254: RN4.2 44.74,9.87 45.36,10.49 LED1.C
N$3
  Top 0.254: RN4.3 43.94,9.63 43.25,10.32 43.25,10.35 | LED4.C 43.12,10.48 43.25,10.35 | 43.25,10.35 43.22,10.35
N$4
  Top 0.305: RN4.4 41.72,10.48 41.1,10.48 LED2.C
N$5  (1 unrouted)
  Top 1.016: U$5.P$1 11.5,2.48 13.59,4.57 F1.2
N$6
  Top 0.254: U1.16 33.04,28.75 32.71,29.08 32.71,30.92 33.21,31.43 33.77,31.43 Q1.1
  Top 0.406: Q1.1 35.11,31.42 C11.2
N$9
  Top 0.406: U1.17 32.23,28.21 31.59,28.86 Q1.3 30.02,29.82 C12.1
N$11
  Top 0.406: Z1.+ 8.41,29.86 10.01,31.46 17.75,31.46 18.79,30.42 20.52,30.42 JP2.2
N$13
  Top 0.305: 29.88,7.54 RN1.1
  Top 0.406: X3.P2 29.88,7.54
N$14
  Top 0.406: X3.P3 30.55,5.19 32.24,6.89 RN1.4
N$15
  Bottom 0.406: 13.59,1.74 13.61,1.74 U$5.P$2
  Bottom 1.016: X1.1 19.2,2.18 17.55,3.83 14.69,3.83 13.59,2.73 13.59,1.74
RAW  (via drill 0.5, 0.6, 0.61)
  Top 0.254: v6.62,36.23 4.85,37.99 4.85,45.05 5.27,45.47 8.19,45.47 8.45,45.72 | 8.88,13.55 8.66,13.33 | XH1.P$1 29.86,47.75 30.08,47.97 | v16.13,47.5
  Top 0.305: v16.13,47.5 15.62,48.01 13.02,48.01 10.73,45.72 8.45,45.72
  Top 0.406: SV2.1 46.68,30.67 45.3,32.04 45.3,32.76 44.98,33.08 44.98,40.56 44.27,41.27 43.55,41.27 C7.2
  Top 0.61: C7.2 43.54,41.87 U2.10 | XH2.P$1 43.16,46.67 31.38,46.67 30.08,47.97 29.97,48.07 | v18.92,46.67 28.45,46.67 30.07,48.3 XH1.P$1
  Top 0.813: v11.5,29.97 11.5,27.94 v12.51,26.92 | 9.15,7.12 9.59,7.57 9.59,8.95 8.95,9.59 v8.95,12.86 8.95,13.04 8.88,13.1
  Top 1.016: D1.C 9.15,7.12 F1.1
  Top 1.27: U3.3 8.88,13.1 8.66,13.33 C14.+
  Bottom 0.254: v6.62,36.23 6.51,36.1
  Bottom 0.61: v18.92,46.67 16.96,46.67 v16.13,47.5
  Bottom 0.813: U2.10 XH2.P$1 | 6.49,36.1 6.51,36.1 6.86,35.75 6.86,34.86 11.5,30.23 v11.5,29.97 | v12.51,26.92 12.51,22.29 9.02,18.79 9.02,12.92 v8.95,12.86
RESET  (via drill 0.6)
  Top 0.254: 35.47,27.03 U1.13 | 40.04,26.44 v39.93,26.4
  Top 0.305: 35.47,27.03 35.43,27.03 35.43,26 35.55,25.87 36.92,25.87 37.25,26.19 39.73,26.19 v39.93,26.4 39.93,27.74 40.73,28.54 42.13,28.54 42.74,29.15 42.74,31 SV1.5
  Top 0.406: 46.72,15.78 46.28,15.34 44.52,15.34 43.52,16.34 | 43.52,16.34 v42.4,17.45 | 43.52,16.34 40.07,12.9 40.07,8.52 D3.A
  Top 0.61: v46.89,15.78 46.72,15.78 | S2.2 38.55,6.53 D3.A 38.32,6.77 R1.1
  Bottom 0.305: v42.4,17.45 42.4,19.08 41.34,20.15 41.34,24.86 v39.93,26.4
  Bottom 0.61: SV2.6 49.21,17.97 v46.89,15.78
UCAP
  Top 0.406: U1.6 39.67,21.33 C5.2
UVCC  (via drill 0.6)
  Top 0.254: v26.52,13.67 24,11.15 24,6.6 24.13,6.48
  Top 0.305: 37.25,18.13 36.6,18.13 36.21,18.52 v36.21,21.36
  Top 0.406: X3.P1 29.22,4.7 27.59,6.34 27.57,6.34 27.43,6.48 24.13,6.48 C6.2 22.07,6.48 21.34,6.48 21.1,6.24 D2.2 | U1.2 37.25,18.13 | v36.21,21.36 v36.2,21.36 36.97,22.13 U1.7
  Bottom 0.305: v26.52,13.67 29.34,13.67 32.83,17.16 32.83,17.99 v36.2,21.36
VCC  (via drill 0.6)
  Top 0.254: 23.12,27.15 L1.1 | 13.93,36.48 C8.2 | v35.6,22.74 36.23,23.38 v36.23,24.89 35.1,24.89 34.64,25.36 U1.14
  Top 0.305: U1.34 28.23,13.78 | 28.23,13.78 28.23,13.6 v30.05,11.78 | v25.01,10.77 25.23,10.77 28.23,13.78
  Top 0.406: J5.4 13.71,36.68 C8.2 | 13.93,36.48 v14.93,35.47 | v19.34,18.71 v22.62,18.71 | v39.76,29.8 v37.36,27.41 | L1.1 21.02,27.23 | 21.02,27.23 19.81,27.23 v19.4,26.81 | v21.09,24.81 21.09,27.16 21.02,27.23
  Top 0.61: R1.2 35.94,8.58 v36.88,9.51 37.76,10.4 D3.C
  Bottom 0.254: 41.52,27.15 SV1.2 | v35.6,22.74 36.23,22.74 37.23,21.74 37.23,19.22 32.83,14.81 32.7,14.81 30.18,12.29 30.18,11.91 v30.05,11.78
  Bottom 0.305: JP1.2 45.48,21.93
  Bottom 0.406: v14.93,35.47 17.7,32.7 17.74,32.7 18.07,32.37 18.07,28.14 v19.4,26.81 | v25.01,10.77 21.46,10.77 19.3,12.93 19.3,18.55 v19.34,18.71 | 45.48,21.93 41.47,25.93 SV1.2 39.76,28.91 v39.76,29.8 | v36.23,24.89 36.23,26.27 v37.36,27.41 | 21.2,24.7 v21.09,24.81 22.62,23.28 v22.62,18.71 | v30.05,11.78 30.05,11.48 32.26,9.27 36.39,9.27 36.64,9.53 36.86,9.53 v36.88,9.51
(copper drawn outside any net)
  shapes: Bottom area x1, Top area x1

### Text on the board
Top: Cervus 2.0
Bottom: Cervus 2.0 | 1538
tPlace: D0 | A5 | D1 | ESP-01 | ML | MR | A4 | A3 | D2 | A2 | D3 | D4~ | A1 | BT | A0 | D5~ | A5 | A4 | A3 | A2 | A1 | D11 | D7 | A0 | GND | D6~ | F | D7 | Buz | Vin | ICSP | < | GND | D8 | 3V3 - 5V | D9~ | ~ | Cervus 2.0 | 5V | D10~ | ~ | 3V3 | D11~ | ~ | D12 | R | L-T/R | 5V | ON | D13~ | * | escornabot.com | GND | CC BY-SA 4.0 | RX | TX | L13 | G | D17 | D24 | Aref | +V
bPlace: RX | D0 | A5 | D1/TX | /D23 | A4/D22 | D2/SDA | A3/D21 | D3~/SCL | CC BY-SA 4.0 | A2/D20 | A1/D19 | D4/A6 | D5~F | A0/D18 | D6~F/A7 | RESET - GND | D7 | D15/SCK - D16/MOSI | Vin | D14/MISO - VCC | GND | D8/A8 | GND | 5V | D9~/A9 | ~ | Vcc / select | 3V3-5V | D10~/A10 | 3V3 | ~ | D11~ | ~ | Reset | D12/A11 | http://escornabot.com | 5V | +5V | D13~ | L13 / ON | GND | * | GND | D24 | Aref | SS/D17 | XDeSIG | GND | +V